# Altium schematic sheet RS232.SchDoc
size 420 x 297 mm; SheetNumber: 9; SheetTotal: 19
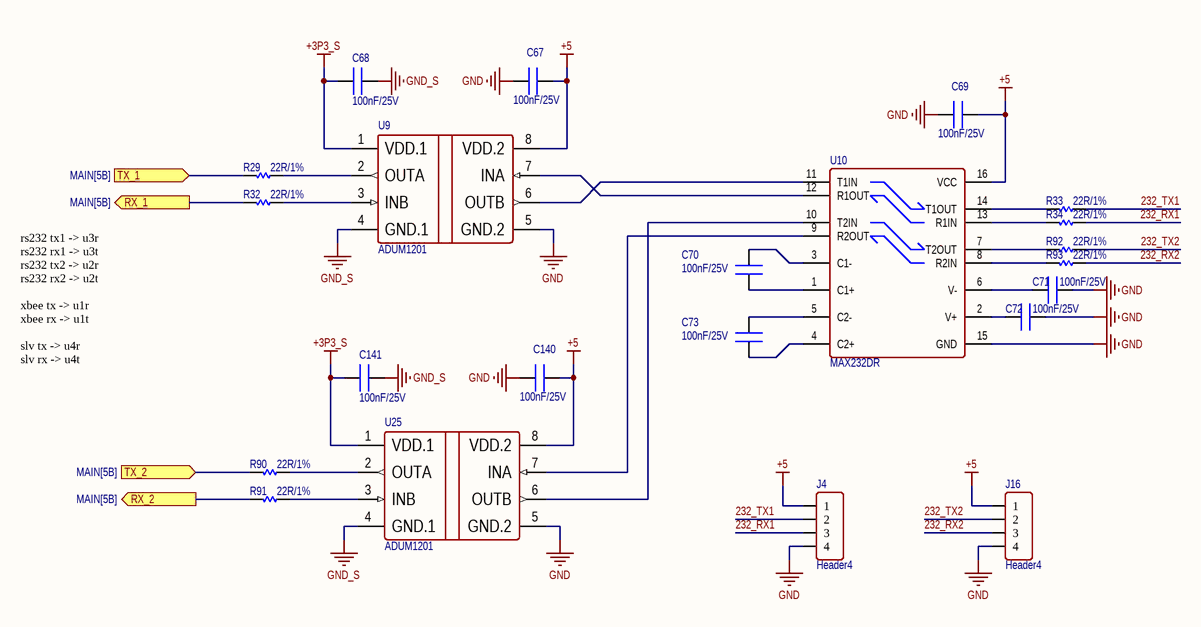
[diagram p0: RS232.SchDoc]

## Parts
C67  100nF/25V  [CN-SMD-0603]
C68  100nF/25V  [CN-SMD-0603]
C69  100nF/25V  [CN-SMD-0603]
C70  100nF/25V  [CN-SMD-0603]
C71  100nF/25V  [CN-SMD-0603]
C72  100nF/25V  [CN-SMD-0603]
C73  100nF/25V  [CN-SMD-0603]
C140  100nF/25V  [CN-SMD-0603]
C141  100nF/25V  [CN-SMD-0603]
J4  Header4  [XH2.54-4-DIP]
J16  Header4  [XH2.54-4-DIP]
R29  22R/1%  [RES-SMD-0603]
R32  22R/1%  [RES-SMD-0603]
R33  22R/1%  [RES-SMD-0603]
R34  22R/1%  [RES-SMD-0603]
R90  22R/1%  [RES-SMD-0603]
R91  22R/1%  [RES-SMD-0603]
R92  22R/1%  [RES-SMD-0603]
R93  22R/1%  [RES-SMD-0603]
U9  ADUM1201  [SO8]
U10  MAX232DR  [SO16]
U25  ADUM1201  [SO8]

## Ports
RX_1 (out, see MAIN[5B]), RX_2 (out, see MAIN[5B]), TX_1 (in, see MAIN[5B]), TX_2 (in, see MAIN[5B])

## Nets
+3P3_S: C68.2 C141.2 U9.1(VDD.1) U25.1(VDD.1)
+5: C67.1 C69.1 C140.1 J4.1 J16.1 U9.8(VDD.2) U10.16(VCC) U25.8(VDD.2)
GND: C67.2 C69.2 C71.1 C72.1 C140.2 J4.4 J16.4 U9.5(GND.2) U10.15(GND) U25.5(GND.2)
GND_S: C68.1 C141.1 U9.4(GND.1) U25.4(GND.1)
232_RX1: J4.3 R34.1
232_RX2: J16.3 R93.1
232_TX1: J4.2 R33.1
232_TX2: J16.2 R92.1
RX_1: R32.2 ; port RX_1
RX_2: R91.2 ; port RX_2
TX_1: R29.2 ; port TX_1
TX_2: R90.2 ; port TX_2
NetC70_1: C70.1 U10.1(C1+)
NetC70_2: C70.2 U10.3(C1-)
NetC71_2: C71.2 U10.6(V-)
NetC72_2: C72.2 U10.2(V+)
NetC73_1: C73.1 U10.4(C2+)
NetC73_2: C73.2 U10.5(C2-)
NetR29_1: R29.1 U9.2(OUTA)
NetR32_1: R32.1 U9.3(INB)
NetR33_2: R33.2 U10.14(T1OUT)
NetR34_2: R34.2 U10.13(R1IN)
NetR90_1: R90.1 U25.2(OUTA)
NetR91_1: R91.1 U25.3(INB)
NetR92_2: R92.2 U10.7(T2OUT)
NetR93_2: R93.2 U10.8(R2IN)
NetU9_6: U9.6(OUTB) U10.11(T1IN)
NetU9_7: U9.7(INA) U10.12(R1OUT)
NetU10_9: U10.9(R2OUT) U25.7(INA)
NetU10_10: U10.10(T2IN) U25.6(OUTB)

## Notes on the sheet
- rs232 tx1 -> u3r
  rs232 rx1 -> u3t
  rs232 tx2 -> u2r
  rs232 rx2 -> u2t
  xbee tx -> u1r
  xbee rx -> u1t
  slv tx -> u4r
  slv rx -> u4t
- Project:
- Sub-system:
- Design by:
- Sheet title:
- Sheet
- of
- Checked by:
- Approved by:
- Document No:
- Revision:
- Size:
- Date:

## Library data of the parts
C67-C73 C140 C141 = CN: CAP CER 0.1UF 25V X7R 0603; PN: CL10B104KA8NNNC
J4 J16 = Header4: Connector 4; Manufacturer: W¨¹rth Elektronik eiSos GmbH; partNo: 613002143121; ComponentLink1 Description: Manufacturer; ComponentLink2 Description: Datasheet; NoPins: 02; Created Date: 29 March 2013; ComponentLink1URL: http://www.we-online.com; ComponentLink2URL: http://katalog.we-online.de/em/datasheet/6130xx143121.pdf; Created by: Karrer Zheng
R29 R32-R34 R90-R93 = Res-SMD: RES SMD 22 OHM 1% 1/10W 0603; PN: ERJ-3EKF22R0V
U9 U25 = ADUM1201: DGTL ISOLTR 2.5KV 2CH GP 8-SOIC; PN: ADUM1201CRZ-RL7
U10 = MAX3232: IC TRANSCEIVER FULL 2/2 16SOIC; PN: MAX232DR